# Altium schematic sheet USBTinyISP-Schematics.SchDoc: USBtinyISP with Buffer
size A4; Author: Meysam Parvizi; DrawnBy: Meysam Parvizi; Engineer: Meysam Parvizi; Revision: V2.0; SheetNumber: 1; SheetTotal: 1
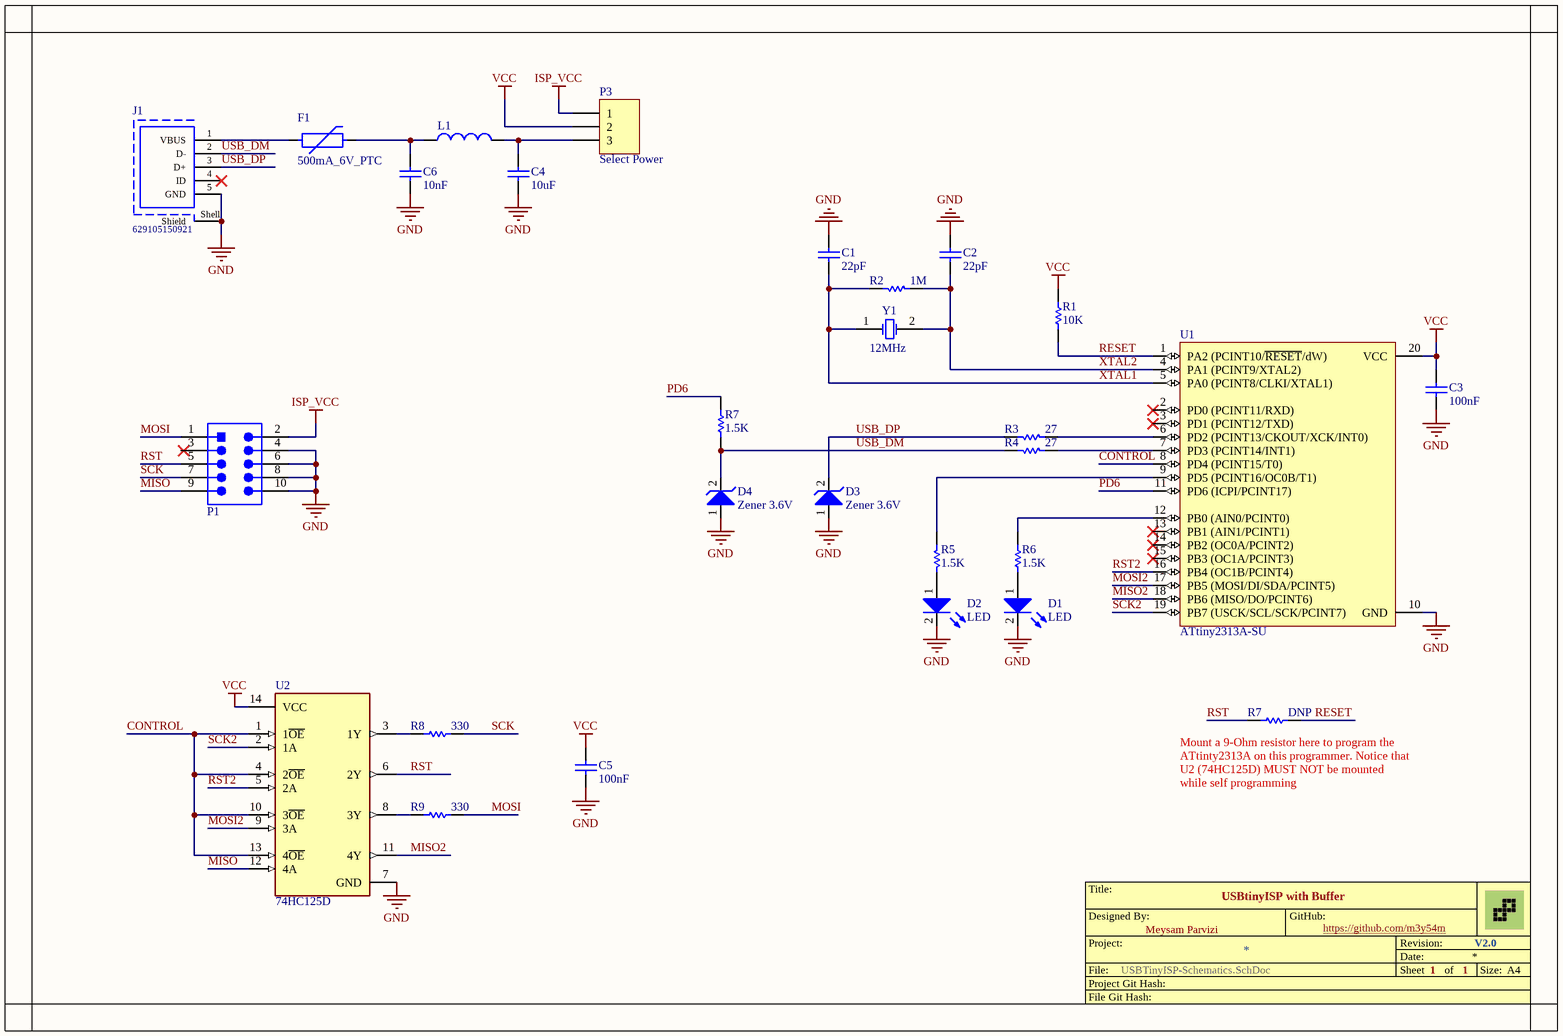
[diagram p0: USBTinyISP-Schematics.SchDoc]

## Parts
(Parts that share a designator on the sheet are numbered #1, #2 ... from top to bottom, then left to right.)
C1  value 22pF  [C0805]  (hidden comment: Cap)
C2  value 22pF  [C0805]  (hidden comment: Cap)
C3  value 100nF  [C0805]  (hidden comment: Cap)
C4  value 10uF  [C0805]  (hidden comment: Cap)
C5  value 100nF  [C0805]  (hidden comment: Cap)
C6  value 10nF  [C0805]  (hidden comment: Cap)
D1  LED  [LED0805]
D2  LED  [LED0805]
D3  Zener 3.6V  [SOD-80]
D4  Zener 3.6V  [SOD-80]
F1  value 500mA_6V_PTC  [R0805]  (hidden comment: MF-PSMF050X-2)
J1  629105150921  [CON-MICRO-USB-B-SMD-WITH-HOLDER]
L1  Ferrite  [R0805]  (value not drawn)
P1  61201021621  [CON-HDR-EDGE-2X5-1.6MM]  (value not drawn)
P3  Select Power  [HDR1X3]
R1  value 10K  [R0805]  (hidden comment: Res1)
R2  value 1M  [R0805]  (hidden comment: Res1)
R3  value 27  [R0805]  (hidden comment: Res1)
R4  value 27  [R0805]  (hidden comment: Res1)
R5  value 1.5K  [R0805]  (hidden comment: Res1)
R6  value 1.5K  [R0805]  (hidden comment: Res1)
R7#1  value 1.5K  [R0805]  (hidden comment: Res1)
R7#2  value DNP  [R0805]  (hidden comment: Res1)
R8  value 330  [R0805]  (hidden comment: Res1)
R9  value 330  [R0805]  (hidden comment: Res1)
U1  ATtiny2313A-SU  [SO20-300MIL]
U2  74HC125D  [SO14-150MIL]
Y1  value 12MHz  [HC-49-US-TH]  (hidden comment: XTAL)

## Nets
GND: C1.1 C2.1 C3.1 C4.2 C5.1 C6.1 D1.2(K) D2.2(K) D3.1(A) D4.1(A) J1.5(GND) J1.Shell(Shield) P1.4 P1.6 P1.8 P1.10 U1.10(GND) U2.7(GND)
ISP_VCC: P1.2 P3.1
VCC: C3.2 C5.2 P3.2 R1.2 U1.20(VCC) U2.14(VCC)
CONTROL: U1.8(PD4_(PCINT15/T0)) U2.1(1~{OE}) U2.4(2~{OE}) U2.10(3~{OE}) U2.13(4~{OE})
MISO: P1.9 U2.12(4A)
MISO2: U1.18(PB6_(MISO/DO/PCINT6)) U2.11(4Y)
MOSI: P1.1 R9.2
MOSI2: U1.17(PB5_(MOSI/DI/SDA/PCINT5)) U2.9(3A)
PD6: R7#1.2 U1.11(PD6_(ICPI/PCINT17))
RESET: R1.1 R7#2.1 U1.1(PA2_(PCINT10/~{RESET}/dW))
RST: P1.5 R7#2.2 U2.6(2Y)
RST2: U1.16(PB4_(OC1B/PCINT4)) U2.5(2A)
SCK: P1.7 R8.2
SCK2: U1.19(PB7_(USCK/SCL/SCK/PCINT7)) U2.2(1A)
USB_DM: D4.2(K) J1.2(D-) R4.1 R7#1.1
USB_DP: D3.2(K) J1.3(D+) R3.1
XTAL1: C1.2 R2.2 U1.5(PA0_(PCINT8/CLKI/XTAL1)) Y1.1(OSC1)
XTAL2: C2.2 R2.1 U1.4(PA1_(PCINT9/XTAL2)) Y1.2(OSC2)
NetC4_1: C4.1 L1.1 P3.3
NetC6_2: C6.2 F1.2 L1.2
NetD1_1: D1.1(A) R6.2
NetD2_1: D2.1(A) R5.2
NetF1_1: F1.1 J1.1(VBUS)
NetR3_2: R3.2 U1.6(PD2_(PCINT13/CKOUT/XCK/INT0))
NetR4_2: R4.2 U1.7(PD3_(PCINT14/INT1))
NetR5_1: R5.1 U1.9(PD5_(PCINT16/OC0B/T1))
NetR6_1: R6.1 U1.12(PB0_(AIN0/PCINT0))
NetR8_1: R8.1 U2.3(1Y)
NetR9_1: R9.1 U2.8(3Y)

Not connected (* = marked no-connect by the designer): J1 4(ID)*; P1 3; U1 2(PD0_(PCINT11/RXD))* 3(PD1_(PCINT12/TXD))* 13(PB1_(AIN1/PCINT1))* 14(PB2_(OC0A/PCINT2))* 15(PB3_(OC1A/PCINT3))*

## Notes on the sheet
- (near R7#2) Mount a 9-Ohm resistor here to program the ATtinty2313A on this programmer. Notice that U2 (74HC125D) MUST NOT be mounted while self programming
- Title:
- Designed By:
- Meysam Parvizi
- GitHub:
- https://github.com/m3y54m
- File:
- Project Git Hash:
- Project:
- Date:
- Sheet
- Revision:
- of
- Size:
- A4
- File Git Hash:

## Library data of the parts
C1-C6 = Cap: Capacitor; Published: 8-Jun-2000; LatestRevisionDate: 17-Jul-2002; LatestRevisionNote: Re-released for DXP Platform.; PackageReference: RAD-0.3; Publisher: Altium Limited; PackageDescription: Radial Cap, Thru-Hole; 2 Leads; 0.3 in Pin Spacing
D1 D2 = LED: Typical LED
D3 D4 = DIODE-ZENER: Zener Diode
F1 = FUSE-PTC: FUSE 500MA SMD (0805) RESETABLE
J1 = CON-MICRO-USB-AB-RCPT-SMD: Micro USB 2.0 Type AB Receptacle WR-COM, Horizontal, SMT; Manufacturer: Wurth Elektronik; Rated Current: 1.8A; Contact Resistance: 30mOhm; Working Voltage: 30VAC; Publisher: WurthElektronik; Part Number: 629105150921; Operating Temperature: -40to85degC; Gender: Receptacle; Packaging: TapeandReel; Connector Type: MicroUSB2.0TypeAB; Datasheet URL: https://katalog.we-online.de/em/datasheet/629105150921.pdf; Mounting Technology: SMT; Orientation: Horizontal; Package Reference: 629105150921; Manufacturer URL: http://www.we-online.de
L1 = Inductor: Code_IEC: 1005; Value: 10uH; Published: 8-Jun-2000; LatestRevisionDate: 29-May-2009; LatestRevisionNote: IPC-7351 Footprint Added.; PackageReference: 0402-A; Publisher: Altium Limited; PackageDescription: Chip Inductor; Code_JEITA: 0402
P1 = BOX-2X5: WR-BHD Box Header, Male, pitch 2.54mm, THT, Straight, 10p; Manufacturer: Wurth Elektronik; Contact Resistance: 20mOhm; Insulation Resistance: 1000MOhm; Number of Positions: 10; Rated Current: 3A; Withstanding Voltage: 500V; Working Voltage: 250V; ComponentLink1Description: Manufacturer Link; ComponentLink1URL: http://www.we-online.de; ComponentLink2Description: Datasheet; ComponentLink2URL: https://www.we-online.com/catalog/datasheet/61201021621.pdf; Gender: Male; Height: 9.1mm; Length: 20.36mm; Manufacturer Part Number: 61201021621; Mounting Technology: THT; Number of Rows: 2; Operating Temperature max.: 105C; Operating Temperature min.: -40C; Orientation: Straight; Packaging: Tray; Pitch: 2.54mm; Width: 9.1mm
P3 = Header 3: Header, 3-Pin; LatestRevisionDate: 17-Jul-2002; LatestRevisionNote: Re-released for DXP Platform.; Publisher: Altium Limited
R1-R6 R7#1 R7#2 R8 R9 = Res1: Resistor; Published: 8-Jun-2000; LatestRevisionDate: 17-Jul-2002; LatestRevisionNote: Re-released for DXP Platform.; PackageReference: AXIAL-0.3; Publisher: Altium Limited; PackageDescription: Axial Device, Thru-Hole; 2 Leads; 0.3 in Pin Spacing
U1 = ATtiny2313A-SU: 8-bit AVR Microcontroller, 1.8-5.5V, 20MHz, 2KB Flash, 128 Bytes EEPROM, 128 Bytes SRAM, 20-pin SOIC, Industrial Grade (-40°C to 85°C), Pb-Free; ComponentLink3URL: http://www.atmel.com/dyn/resources/prod_documents/8246S.pdf; ComponentLink2Description: ATtiny2313A/4313 Datasheet; Code_JEDEC: MS-013-AC; RevisionNote: DatasheetVersion & PackageVersion updated. URLs added.; ComponentLink1Description: Manufacturer URL; Code_IPC: SOIC127P1030-20; ComponentLink1URL: http://www.atmel.com/; ComponentLink3Description: ATtiny2313A/4313 Summary; DatasheetVersion: revB, Oct-2011; PackageVersion: revB, Nov-2006; PackageDescription: 20-lead, 0.300" Wide Body, Plastic Gull Wing Small Outline Package (SOIC); ComponentLink2URL: http://www.atmel.com/dyn/resources/prod_documents/doc8246.pdf; PackageReference: 20S
U2 = 74HC125D: IC BUFFER NON-INVERT 6V 14SOIC; Number of Bits: 4; Turn-On Delay Time: 150ns; Number of Bits per Element: 1; Operating Supply Voltage: 5V; Polarity: Non-Inverting; Output Current: 7.8mA; Output Type: 3-STATE; Quiescent Current: 8uA; Propagation Delay: 190ns; High Level Output Current: -7.8mA; Min Supply Voltage: 2V; RoHS Compliant: Yes; Package Quantity: 2500; Lead Free: Lead Free; Number of Pins: 14; Number of Outputs: 4; Height: 1.58mm; REACH SVHC: No SVHC; Packaging: Tape and Reel; Length: 8.65mm; Number of Channels: 4; Width: 3.91mm; Low Level Output Current: 7.8mA; Number of Circuits: 4; Series: 74HC; Min Operating Temperature: -40°C; Number of Inputs: 4; Logic Function: Buffer; Case/Package: SOIC; Mount: Surface Mount; Technology: CMOS; Number of Input Lines: 4; Max Supply Voltage: 6V; Max Operating Temperature: 85°C; Number of Elements: 4; Contact Plating: Gold; Number of Output Lines: 4; Radiation Hardening: No
Y1 = XTAL: Crystal Oscillator; Designer: Meysam Parvizi; Email: meysam.parvizi.ir@gmail.com; Weblog: http://mp.tabin.ir